# EAGLE design MCAT-CANVYAL-T2-5X (EAGLE 7.2.0)
DATECODE: 20150302102847; REV: 5X
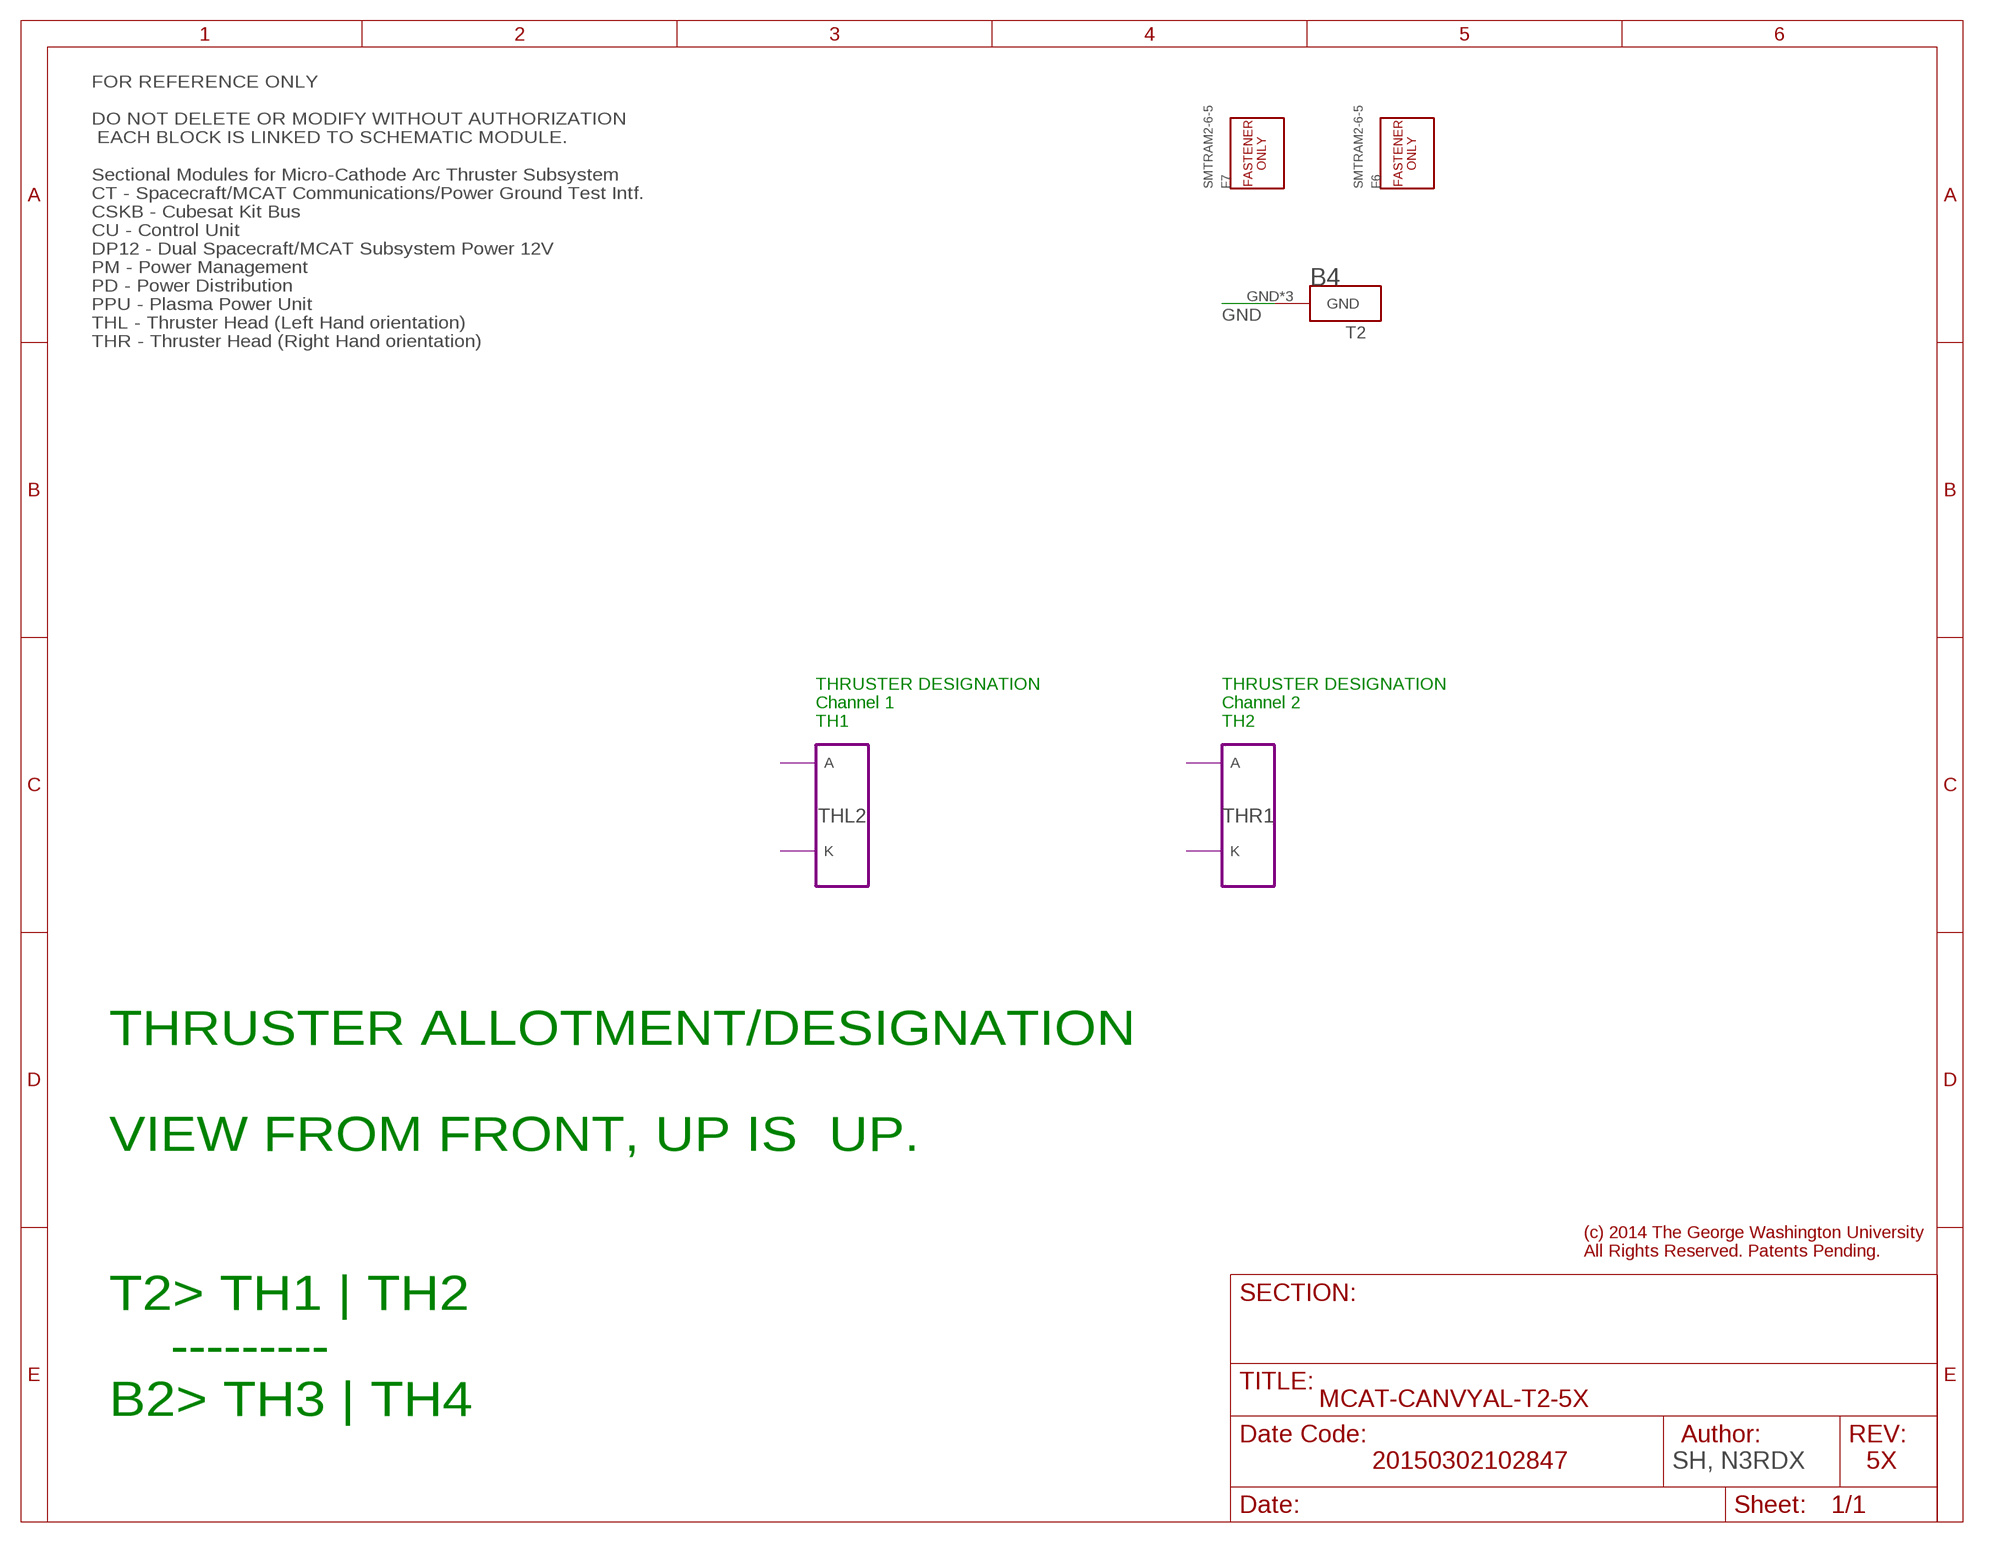
[diagram p0: schematic, sheet 1]

## Parts
B4  MCAT-4CU-C-PCB/MID  [MCAT-4CU-C-MID-V4-BLANK]
F6  SMTRAM2-6-5  [SMTRA-M2-6-5]
F7  SMTRAM2-6-5  [SMTRA-M2-6-5]

## Module instances
THL2 = TH-LH-G4X
THR1 = TH-RH-G4X

## Nets
GND: B4.GND B4.GND@2(GND) B4.GND@3(GND)

## Notes on the sheet
- FOR REFERENCE ONLY
  
  DO NOT DELETE OR MODIFY WITHOUT AUTHORIZATION
   EACH BLOCK IS LINKED TO SCHEMATIC MODULE.
  
  Sectional Modules for Micro-Cathode Arc Thruster Subsystem
  CT - Spacecraft/MCAT Communications/Power Ground Test Intf.
  CSKB - Cubesat Kit Bus
  CU - Control Unit
  DP12 - Dual Spacecraft/MCAT Subsystem Power 12V
  PM - Power Management
  PD - Power Distribution
  PPU - Plasma Power Unit
  THL - Thruster Head (Left Hand orientation)
  THR - Thruster Head (Right Hand orientation)
- THRUSTER DESIGNATION
  Channel 1
  TH1
- THRUSTER DESIGNATION
  Channel 2
  TH2
- THRUSTER ALLOTMENT/DESIGNATION
  
  VIEW FROM FRONT, UP IS  UP.
  
  
  T2> TH1 | TH2
      ---------
  B2> TH3 | TH4
- SH, N3RDX

## Library data of the parts
B4 = gwu_mpnl_ucat_v10:MCAT-4CU-C-PCB; COPYRIGHT: (c) 2015, GWU; PCBLABEL: T2
F6 F7 = gwu_mpnl_ucat_v10:SMTRA: Type SMTRA - ReelFast Surface Mount Right Angle (R'ANGLE) Fastener (Metric); MF: Penn Engineering; MPN: SMTRAM2-6-5-DT

## Module TH-LH-G4X
Ports: A(io) K(io)
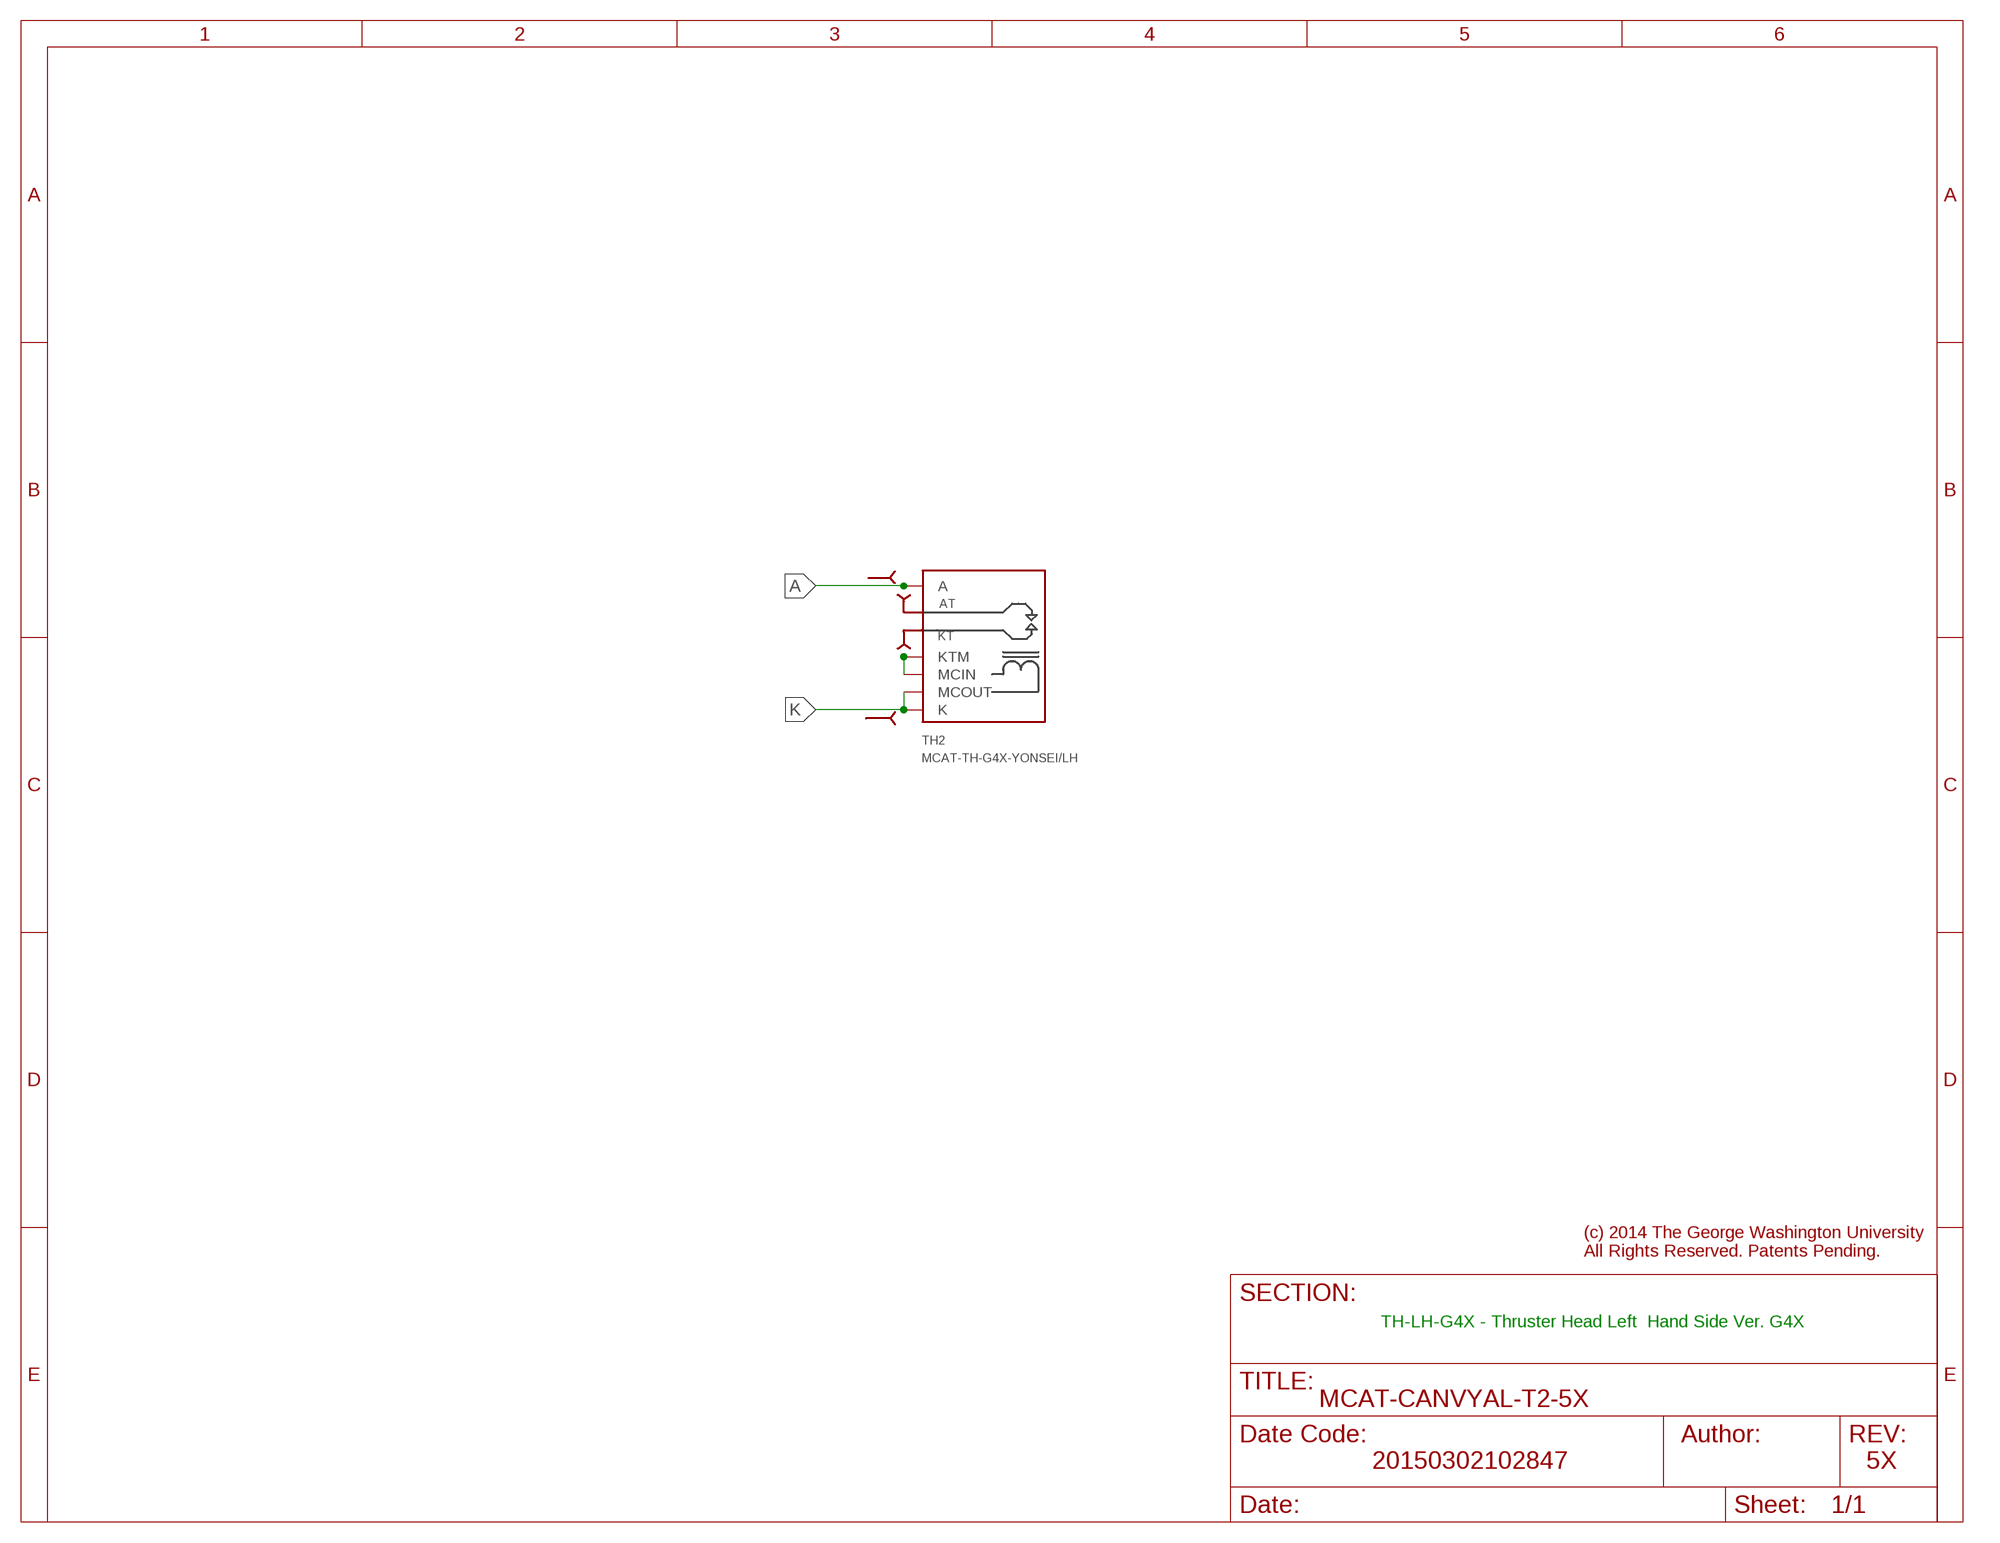
[diagram p1: schematic, module TH-LH-G4X, sheet 1]

### Parts
TH2  MCAT-TH-G4X-YONSEI/LH  [MCAT-TH-G4X-LH]

### Nets
A: TH2.A
K: TH2.K TH2.MCOUT
KTMMCIN: TH2.KTM TH2.MCIN

### Notes on the sheet
- TH-LH-G4X - Thruster Head Left  Hand Side Ver. G4X

### Library data of the parts
TH2 = gwu_mpnl_ucat_v10:MCAT-TH-G4X-YONSEI: Thruster for CANYVAL bus. Note LH and RH orientations are separate, and opposing pin arrangements. Layers are also flipped. A = spade terminal lug for anode connection from PPU AT = spade terminal connection to thruster anode terminal, manual connection! KT = spade terminal connection to thruster cathode terminal, manual connection! MKT = spade terminal lug for KT connection to Magnetic Coil MCIN = pad for Magnetic Coil input MCOUT = pad for Magnetic Coil output K = spade terminal connection to ground bus from PPU

## Module TH-RH-G4X
Ports: A(io) K(io)
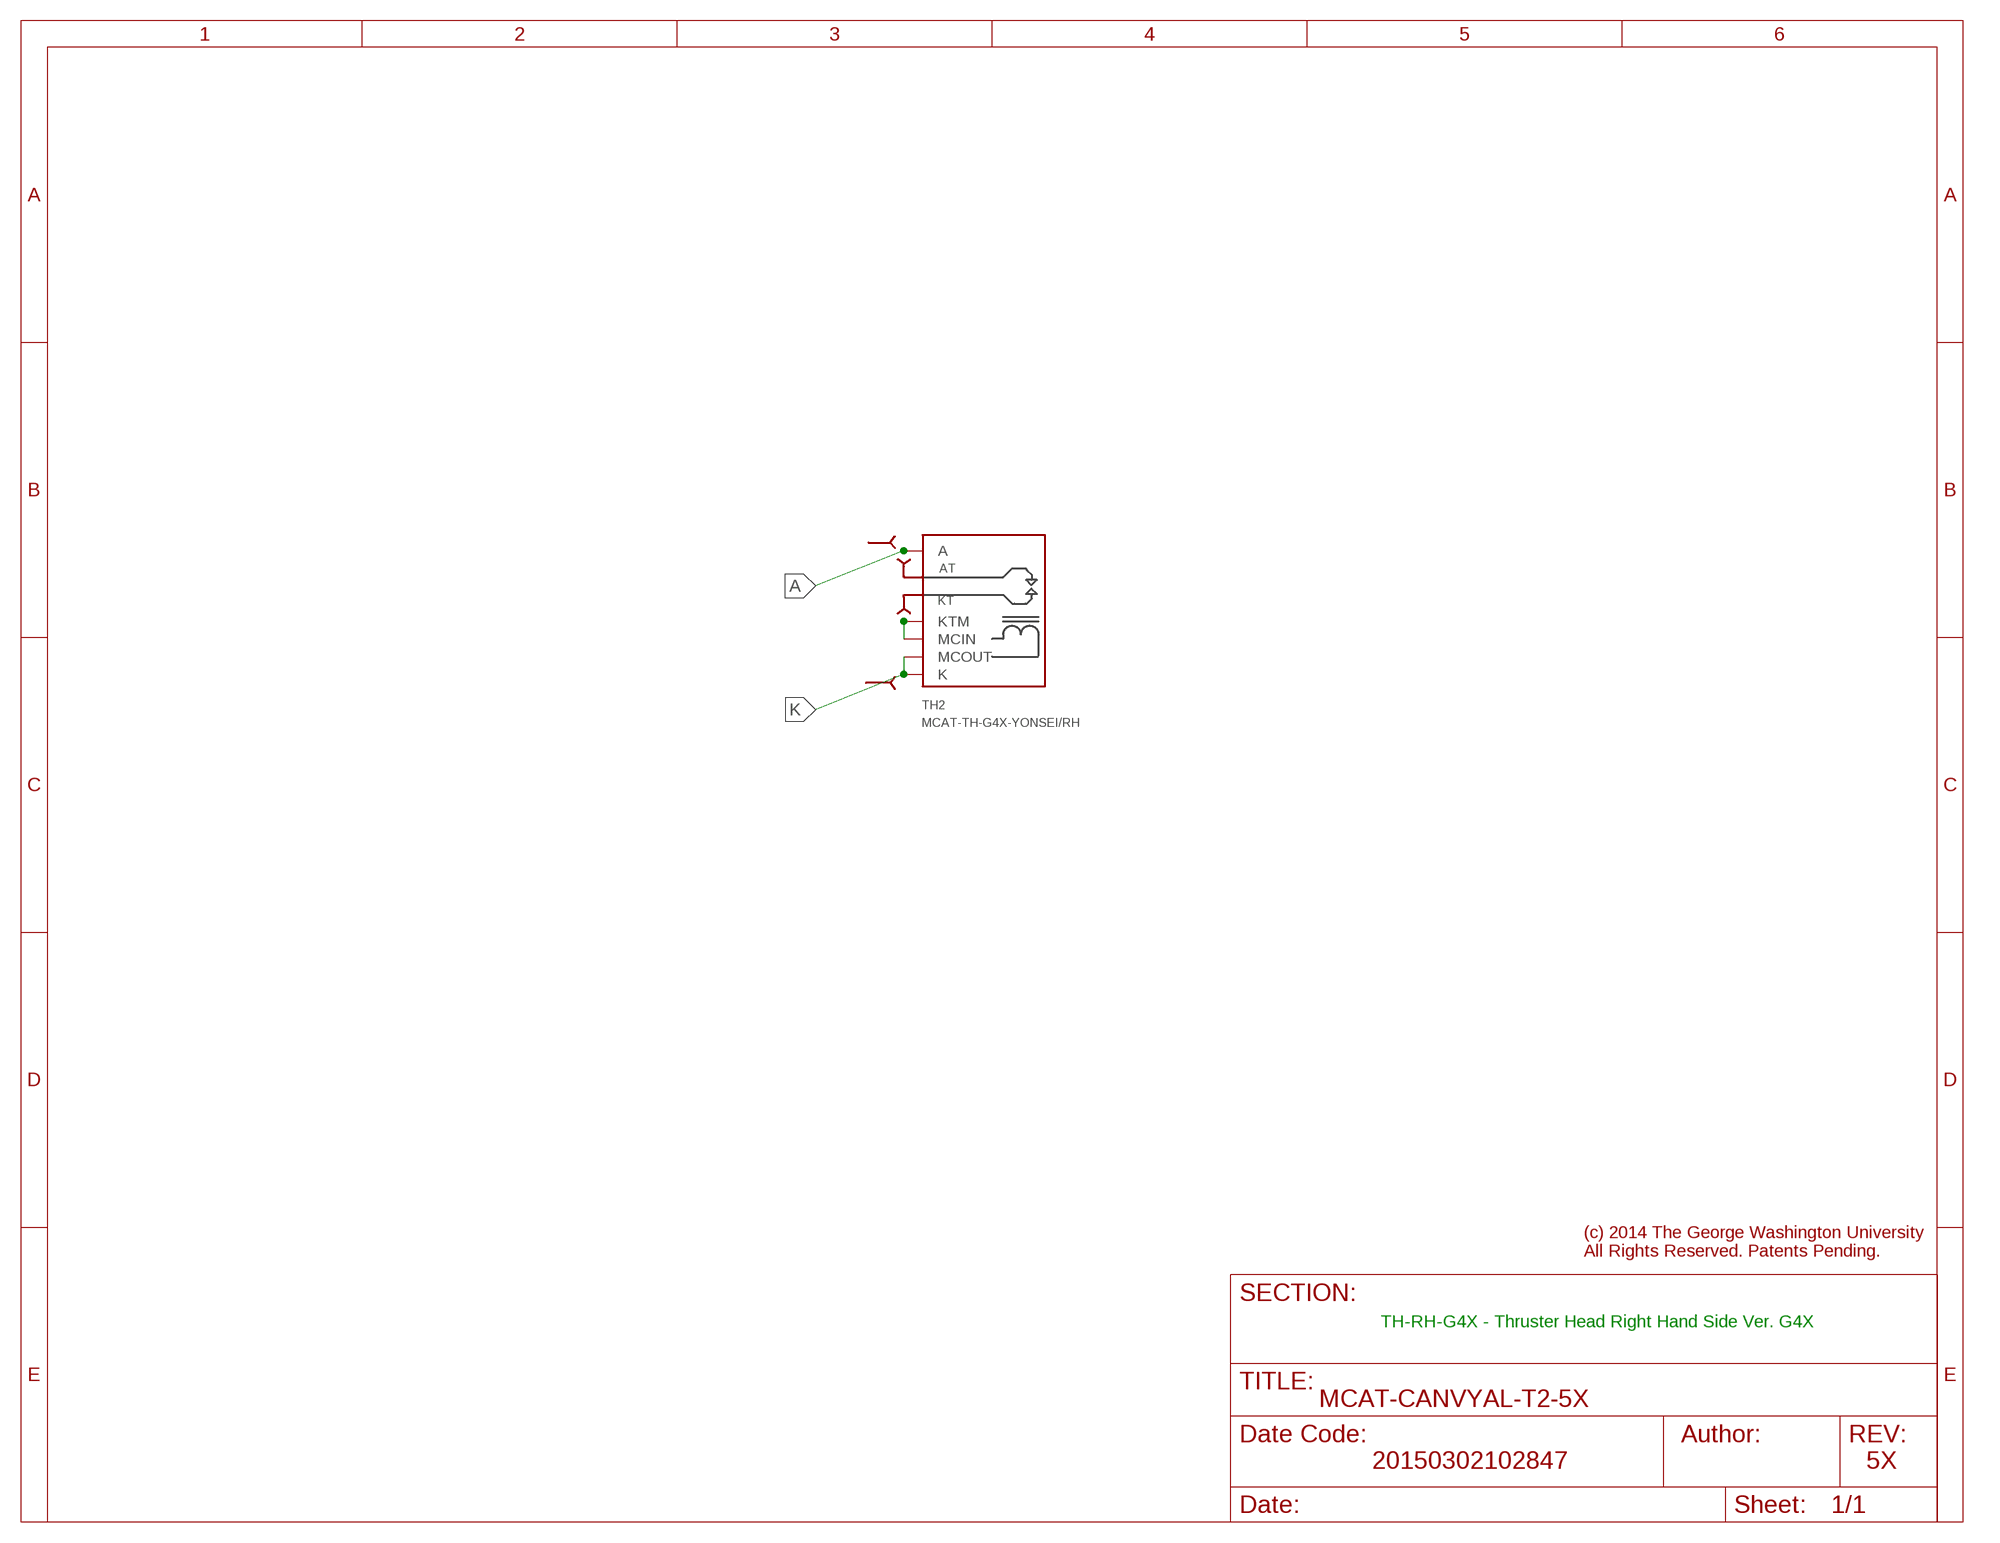
[diagram p2: schematic, module TH-RH-G4X, sheet 1]

### Parts
TH2  MCAT-TH-G4X-YONSEI/RH  [MCAT-TH-G4X-RH]

### Nets
A: TH2.A
K: TH2.K TH2.MCOUT
KTMMCIN: TH2.KTM TH2.MCIN

### Notes on the sheet
- TH-RH-G4X - Thruster Head Right Hand Side Ver. G4X

### Library data of the parts
TH2 = gwu_mpnl_ucat_v10:MCAT-TH-G4X-YONSEI: Thruster for CANYVAL bus. Note LH and RH orientations are separate, and opposing pin arrangements. Layers are also flipped. A = spade terminal lug for anode connection from PPU AT = spade terminal connection to thruster anode terminal, manual connection! KT = spade terminal connection to thruster cathode terminal, manual connection! MKT = spade terminal lug for KT connection to Magnetic Coil MCIN = pad for Magnetic Coil input MCOUT = pad for Magnetic Coil output K = spade terminal connection to ground bus from PPU

## Net classes
1 vout1a2ozcu: width 0.406 mm

## Board
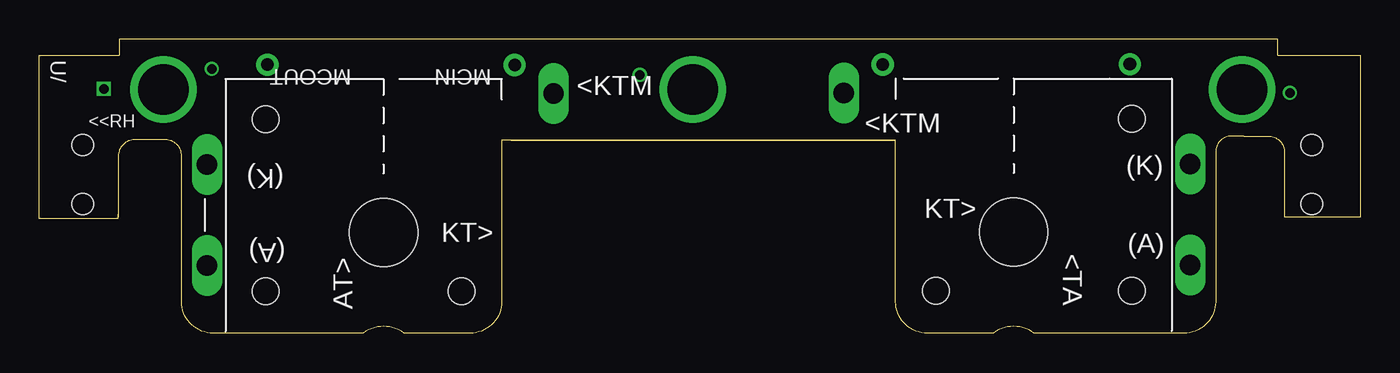
[diagram p3: board, top side]
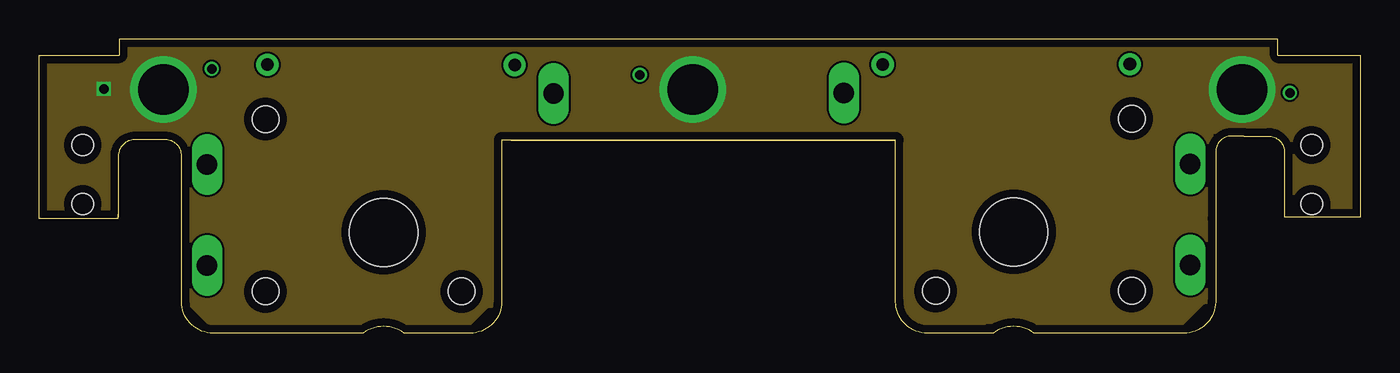
[diagram p4: board, inner layer L2/TopGround]
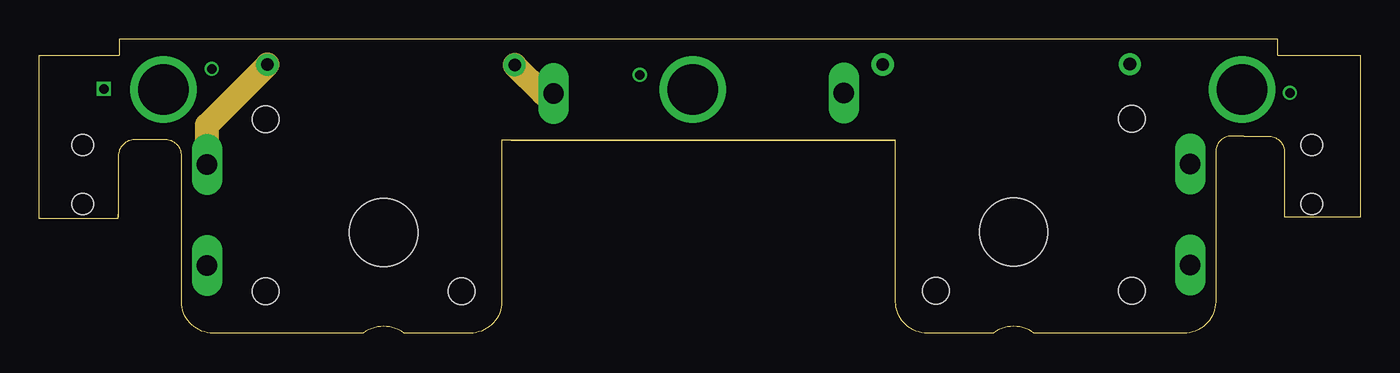
[diagram p5: board, inner layer L3/Power1]
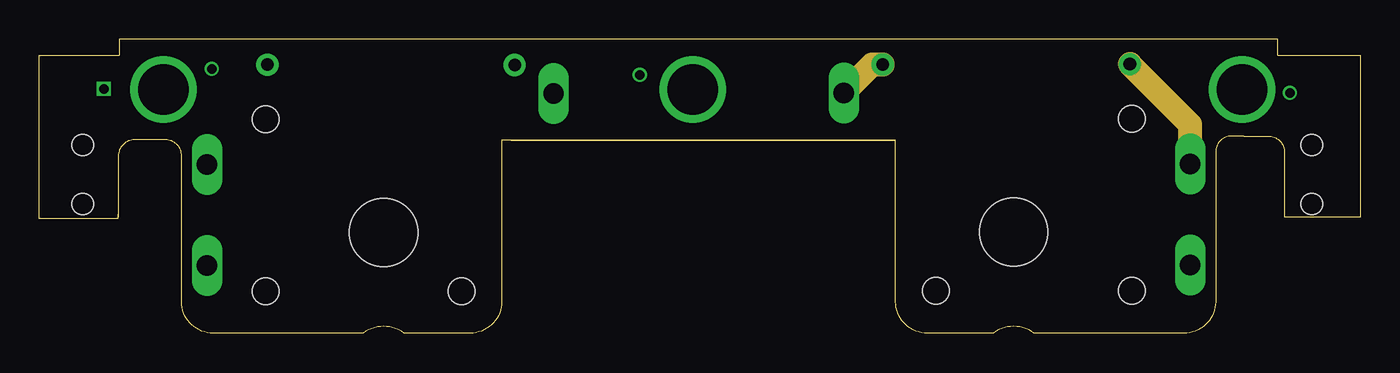
[diagram p6: board, inner layer L14/Power2]
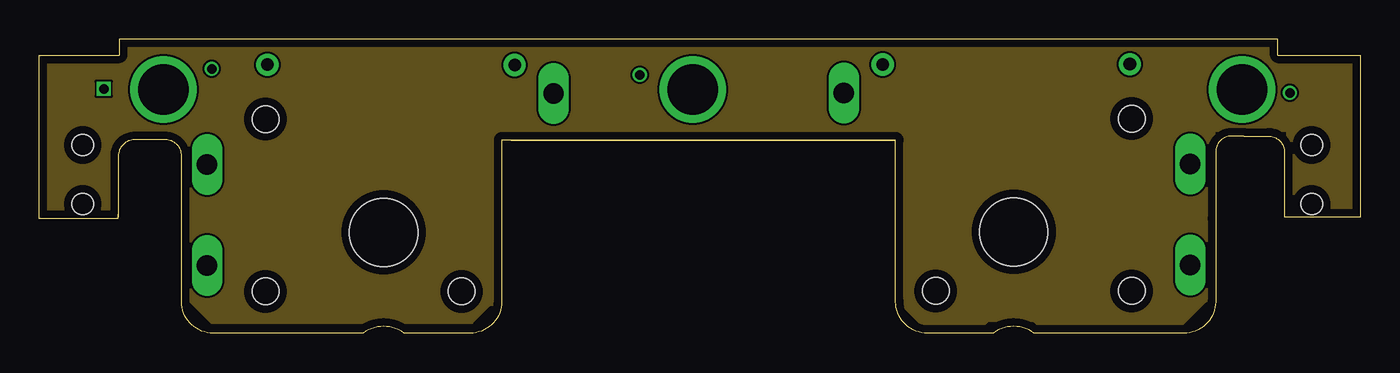
[diagram p7: board, inner layer L15/BottomGround]
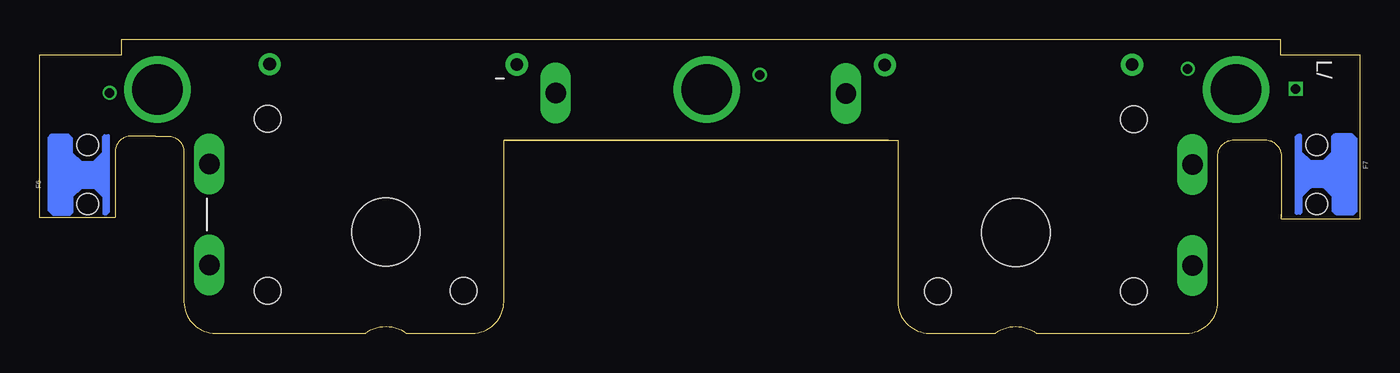
[diagram p8: board, bottom side, seen from below]

Size 83.86 x 18.64 mm. Coordinates in mm from the lower left corner, seen from the top.
Copper layers (1+2*3+14*15+16): L1/TopSignal 0.035559375mm / dielectric 3.5mil / L2/TopGround 0.01778125mm / dielectric 47mil / L3/Power1 0.0356mm / dielectric 12mil / L14/Power2 0.0356mm / dielectric 0.1499mm / L15/BottomGround 0.01778125mm / dielectric 3.5mil / L16/BottomSignal 0.035559375mm
Design rules "mcat-4cu-c-X3 *": minimum track width 2mil, minimum drill 8mil, track to track 5mil, track to pad 5mil, pad to pad 5mil, via to via 5mil, smd to smd 5mil, copper to edge 20mil, drill to drill 5mil, minimum pad ring 12mil, minimum via ring 4mil, stop-mask expansion 0mil, vias tented up to drill 8mil, thermal gap 10mil

### Footprints (pad centres in the part's own frame; a part is rotated, then mirrored left to right if it is on the bottom)
MCAT-4CU-C-MID-V4-BLANK = drill 3.2: GND -75.98,-3.18; GND@2 -42.36,-3.18; GND@3 -7.5,-3.18
SMTRA-M2-6-5 = hole 1.35: -1.869,0; 1.869,0
MCAT-TH-G4X-LH = drill 1.3 long: A 11.82,18.7; K 5.42,18.7; KTM 0.9,-3.3 | drill 0.8: MCIN -0.9,-0.83; MCOUT -0.92,14.864 | hole 1.676: 2.54,14.986; 13.462,14.986; 13.462,2.54 | hole 4.318: 9.721,7.493
MCAT-TH-G4X-RH = drill 1.3 long: A -18.712,-11.788; K -18.712,-5.388; KTM 3.288,-0.868 | drill 0.8: MCIN 0.818,0.932; MCOUT -14.876,0.952 | hole 1.676: -14.998,-2.508; -14.998,-13.43; -2.552,-13.43 | hole 4.318: -7.505,-9.689

### Placement (x,y rotation side)
B4  83.86,18.64 0 top
F6  80.78,10.07 90 bottom
F7  2.75,10.07 270 bottom
THL2:TH2  MCAT-TH-G4X-YONSEI/LH  [MCAT-TH-G4X-LH]  29.35,16.12 270 bottom
THR1:TH2  MCAT-TH-G4X-YONSEI/RH  [MCAT-TH-G4X-RH]  54.36,16.12 0 bottom

### Tracks (layer width: path | path; a pad name or v marks a point on that pad's centre or on a via)
GND  (via drill 0.6)
  other vias: 4.09,15.51
  pour L2/TopGround (no thermals): 0.53,17.28 5.36,17.28 5.36,18.43 78.38,18.43 78.38,17.41 83.72,17.41 83.72,7.51 79.27,7.51 79.14,7.51 79.14,12.71 74.44,12.71 74.44,1.92 73.94,1.92 72.29,0.27 63.4,0.27 63.01,0.65 60.6,0.65 60.09,0.65 59.71,0.27 56.03,0.27 54.51,1.79 54.51,12.46 29.36,12.46 28.98,12.08 28.98,1.66 28.47,1.66 27.33,0.52 10.82,0.52 9.29,2.04 9.29,11.57 8.4,12.46 5.48,12.46 4.72,11.7 4.72,7.38 0.4,7.38 0.15,7.63 0.15,16.9
GND1
  pour L15/BottomGround (no thermals): 0.66,17.41 5.48,17.41 5.48,18.55 78.51,18.55 78.51,17.54 83.84,17.54 83.84,7.63 79.4,7.63 79.27,7.63 79.27,12.84 74.57,12.84 74.57,2.04 74.06,2.04 72.41,0.39 63.52,0.39 63.14,0.77 60.73,0.77 60.22,0.77 59.84,0.39 56.16,0.39 54.63,1.92 54.63,12.59 29.49,12.59 29.11,12.2 29.11,1.79 28.6,1.79 27.45,0.65 10.94,0.65 9.42,2.17 9.42,11.7 8.53,12.59 5.61,12.59 4.85,11.82 4.85,7.51 0.53,7.51 0.28,7.76 0.28,17.03
N$2  (via drill 0.6)
  other vias: 10.94,16.78
N$3  (via drill 0.6)
  other vias: 38.12,16.4
N$4  (via drill 0.6)
  other vias: 79.4,15.25
THL2:K
  L3/Power1 1.524: THL2:TH2.K 10.65,13.2 THL2:TH2.MCOUT
THL2:KTMMCIN
  L3/Power1 1.524: THL2:TH2.KTM 31.98,15.22 THL2:TH2.MCIN
THR1:K
  L14/Power2 1.524: THR1:TH2.K 73.07,13.23 THR1:TH2.MCOUT
THR1:KTMMCIN
  L14/Power2 1.524: THR1:TH2.MCIN 52.87,17.05 THR1:TH2.KTM